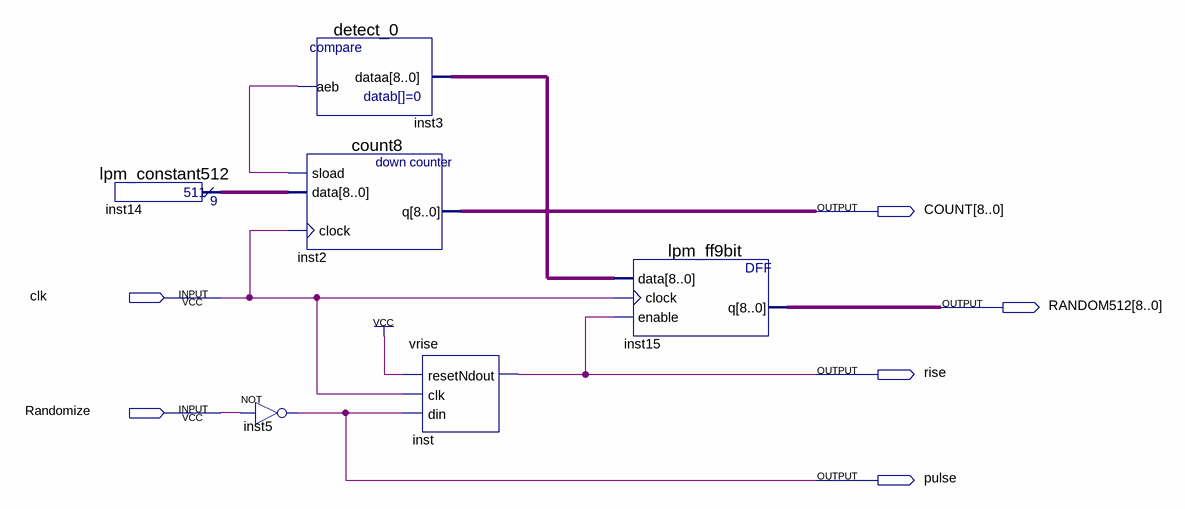
[diagram p0: schematic sheet]
// Quartus schematic random512.bdf as structural Verilog: 6 symbols, 6 pins
module random512 (
  input  clk,
  input  Randomize,
  output [8:0] COUNT,
  output [8:0] RANDOM512,
  output rise,
  output pulse
);

  wire inst3_aeb;
  wire [8:0] inst14_result;

  lpm_constant512 inst14 (.result(inst14_result));
  detect_0 inst3 (.dataa(COUNT), .aeb(inst3_aeb));
  count8 inst2 (.sload(inst3_aeb), .data(inst14_result), .clock(clk), .q(COUNT));
  not inst5 (pulse, Randomize);
  vrise inst (.resetN(1'b1), .clk(clk), .din(pulse), .dout(rise));
  lpm_ff9bit inst15 (.data(COUNT), .clock(clk), .enable(rise), .q(RANDOM512));
endmodule
